# EAGLE design esquema_placa_v2 (EAGLE 9.4.2)
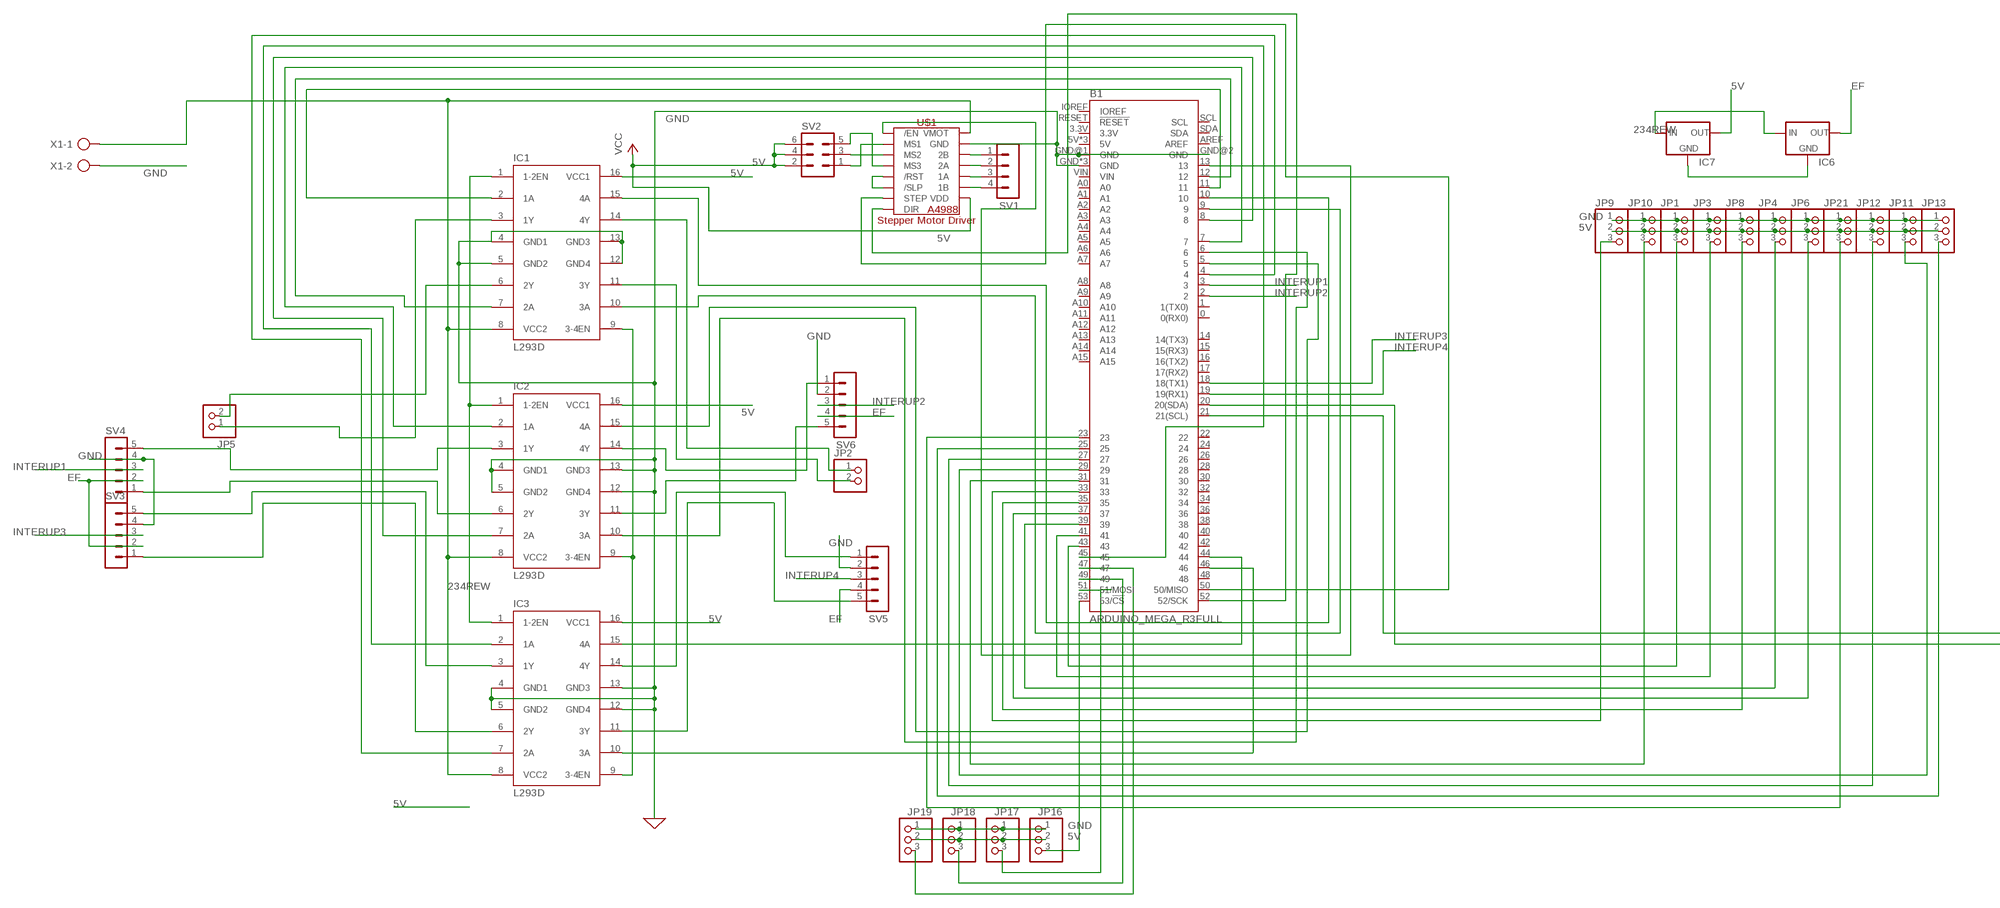
[diagram p0: schematic, sheet 1, part 1 of 2]
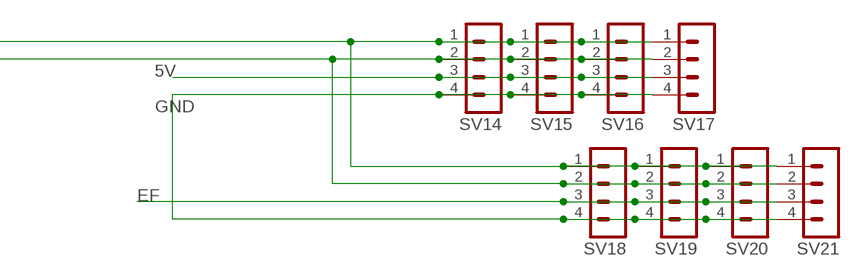
[diagram p1: schematic, sheet 1, part 2 of 2]

## Parts
B1  ARDUINO_MEGA_R3FULL  [ARDUINO_MEGA_NO_SILK]
IC1  L293D  [DIL16]
IC2  L293D  [DIL16]
IC3  L293D  [DIL16]
IC6  78XXS  [78XXS]
IC7  78XXS  [78XXS]
JP1  PINHD-1X3  [1X03]
JP2  PINHD-1X2  [1X02]
JP3  PINHD-1X3  [1X03]
JP4  PINHD-1X3  [1X03]
JP5  PINHD-1X2  [1X02]
JP6  PINHD-1X3  [1X03]
JP8  PINHD-1X3  [1X03]
JP9  PINHD-1X3  [1X03]
JP10  PINHD-1X3  [1X03]
JP11  PINHD-1X3  [1X03]
JP12  PINHD-1X3  [1X03]
JP13  PINHD-1X3  [1X03]
JP16  PINHD-1X3  [1X03]
JP17  PINHD-1X3  [1X03]
JP18  PINHD-1X3  [1X03]
JP19  PINHD-1X3  [1X03]
JP21  PINHD-1X3  [1X03]
SV1  MA04-1  [MA04-1]
SV2  MA03-2  [MA03-2]
SV3  MA05-1  [MA05-1]
SV4  MA05-1  [MA05-1]
SV5  MA05-1  [MA05-1]
SV6  MA05-1  [MA05-1]
SV14  MA04-1  [MA04-1]
SV15  MA04-1  [MA04-1]
SV16  MA04-1  [MA04-1]
SV17  MA04-1  [MA04-1]
SV18  MA04-1  [MA04-1]
SV19  MA04-1  [MA04-1]
SV20  MA04-1  [MA04-1]
SV21  MA04-1  [MA04-1]
U$1  A4988_STEP  [A4988_STEP]
X1  AK500/2-H  [AK500/2-H]

## Nets
5V: IC1.1(1-2EN) IC1.9(3-4EN) IC1.16(VCC1) IC2.1(1-2EN) IC2.9(3-4EN) IC2.16(VCC1) IC3.1(1-2EN) IC3.9(3-4EN) IC3.16(VCC1) IC7.OUT JP1.2 JP3.2 JP4.2 JP6.2 JP8.2 JP9.2 JP10.2 JP11.2 JP12.2 JP13.2 JP16.2 JP17.2 JP18.2 JP19.2 JP21.2 SV2.2 SV2.4 SV2.6 SV14.3 SV15.3 SV16.3 SV17.3 U$1.VDD ; supply symbol labelled VCC
234REW: IC1.8(VCC2) IC2.8(VCC2) IC3.8(VCC2) IC6.IN IC7.IN U$1.VMOT X1.1
EF: IC6.OUT SV3.2 SV4.2 SV5.4 SV6.4 SV18.3 SV19.3 SV20.3 SV21.3
GND: B1.GND B1.GND@1(GND) B1.GND@2(GND) B1.GND@3(GND) B1.GND@4(GND) IC1.4(GND1) IC1.5(GND2) IC1.12(GND4) IC1.13(GND3) IC2.4(GND1) IC2.5(GND2) IC2.12(GND4) IC2.13(GND3) IC3.4(GND1) IC3.5(GND2) IC3.12(GND4) IC3.13(GND3) IC6.GND IC7.GND JP1.1 JP3.1 JP4.1 JP6.1 JP8.1 JP9.1 JP10.1 JP11.1 JP12.1 JP13.1 JP16.1 JP17.1 JP18.1 JP19.1 JP21.1 SV3.4 SV4.4 SV5.2 SV6.2 SV14.4 SV15.4 SV16.4 SV17.4 SV18.4 SV19.4 SV20.4 SV21.4 U$1.GND U$1.GND2(GND) X1.2
INTERUP1: B1.3 SV4.3
INTERUP2: B1.2 SV6.3
INTERUP3: B1.18(18(TX1)) SV3.3
INTERUP4: B1.19(19(RX1)) SV5.3
N$1: B1.53(53/!CS) JP16.3
N$2: IC1.3(1Y) JP5.1
N$3: IC1.6(2Y) JP5.2
N$4: IC2.3(1Y) SV4.5
N$5: B1.45 IC3.2(1A)
N$6: IC2.6(2Y) SV4.1
N$7: IC3.3(1Y) SV3.5
N$8: IC3.6(2Y) SV3.1
N$9: IC2.14(4Y) SV6.1
N$10: IC2.11(3Y) SV6.5
N$11: IC3.14(4Y) SV5.1
N$12: IC3.11(3Y) SV5.5
N$13: IC1.11(3Y) JP2.2
N$14: IC1.14(4Y) JP2.1
N$15: B1.12 IC1.7(2A)
N$16: B1.11 IC1.2(1A)
N$17: B1.7 IC2.2(1A)
N$18: B1.8 IC2.7(2A)
N$19: B1.43 JP1.3
N$20: B1.4 IC3.7(2A)
N$21: B1.10 IC1.15(4A)
N$22: B1.9 IC1.10(3A)
N$23: B1.5 IC2.15(4A)
N$24: B1.6 IC2.10(3A)
N$25: U$1./RST U$1./SLP
N$26: B1.46 IC3.10(3A)
N$27: B1.41 JP3.3
N$28: SV1.1 U$1.2B
N$29: SV1.2 U$1.2A
N$30: SV1.3 U$1.1A
N$31: SV1.4 U$1.1B
N$32: SV2.3 U$1.MS2
N$33: SV2.1 U$1.MS1
N$34: SV2.5 U$1.MS3
N$35: B1.44 IC3.15(4A)
N$36: B1.13 U$1./EN
N$37: B1.50(50/MISO) U$1.STEP
N$38: B1.52(52/SCK) U$1.DIR
N$39: B1.39 JP4.3
N$40: B1.51(51/MOSI) JP17.3
N$41: B1.49 JP18.3
N$42: B1.47 JP19.3
N$43: B1.37 JP6.3
N$44: B1.35 JP8.3
N$45: B1.33 JP9.3
N$46: B1.31 JP10.3
N$47: B1.29 JP11.3
N$48: B1.27 JP12.3
N$49: B1.25 JP13.3
N$50: B1.20(20(SDA)) SV14.2 SV15.2 SV16.2 SV17.2 SV18.2 SV19.2 SV20.2 SV21.2
N$52: B1.23 JP21.3
N$57: B1.21(21(SCL)) SV14.1 SV15.1 SV16.1 SV17.1 SV18.1 SV19.1 SV20.1 SV21.1
Unconnected: B1.0(0(RX0)) B1.1(1(TX0)) B1.3.3V B1.5V B1.5V@1(5V) B1.5V@2(5V) B1.14(14(TX3)) B1.15(15(RX3)) B1.16(16(TX2)) B1.17(17(RX2)) B1.22 B1.24 B1.26 B1.28 B1.30 B1.32 B1.34 B1.36 B1.38 B1.40 B1.42 B1.48 B1.A0 B1.A1 B1.A2 B1.A3 B1.A4 B1.A5 B1.A6 B1.A7 B1.A8 B1.A9 B1.A10 B1.A11 B1.A12 B1.A13 B1.A14 B1.A15 B1.AREF B1.IOREF B1.RESET(!RESET) B1.SCL B1.SDA B1.VIN

## Library data of the parts
B1 = Arduino:ARDUINO_MEGA_R3: Arduino Mega R3 ATmega2560 R3 compatible footprint. SparkFun Products: Arduino Mega 2560 R3 <https://www.sparkfun.com/products/11061>
IC1-IC3 = st-microelectronics:L293D: PUSH-PULL 4 CHANNEL DRIVER; MPN: L293D; OC_FARNELL: 9589619; OC_NEWARK: 56P8249
IC6 IC7 = v-reg:78XXS: VOLTAGE REGULATOR
JP1 JP3 JP4 JP6 JP8-JP13 JP16-JP19 JP21 = pinheadRounded:PINHD-1X3: PIN HEADER
JP2 JP5 = pinhead:PINHD-1X2: PIN HEADER
SV1 = con-lstb:MA04-1: PIN HEADER; OC_FARNELL: unknown; OC_NEWARK: unknown
SV2 = con-lstb:MA03-2: PIN HEADER; OC_FARNELL: unknown; OC_NEWARK: unknown
SV3-SV6 = con-lstb:MA05-1: PIN HEADER; OC_FARNELL: unknown; OC_NEWARK: unknown
SV14-SV21 = pin4round:MA04-1: PIN HEADER; OC_FARNELL: unknown; OC_NEWARK: unknown
U$1 = IC:A4988_STEP
X1 = con-ptr500:AK500/2-H: CONNECTOR Aug. 2004 / PTR Meßtechnik: Die Bezeichnung der Serie AK505 wurde geändert. Es handelt sich hierbei um AK500 in horizontaler Ausführung.; OC_FARNELL: unknown; OC_NEWARK: unknown

## Board
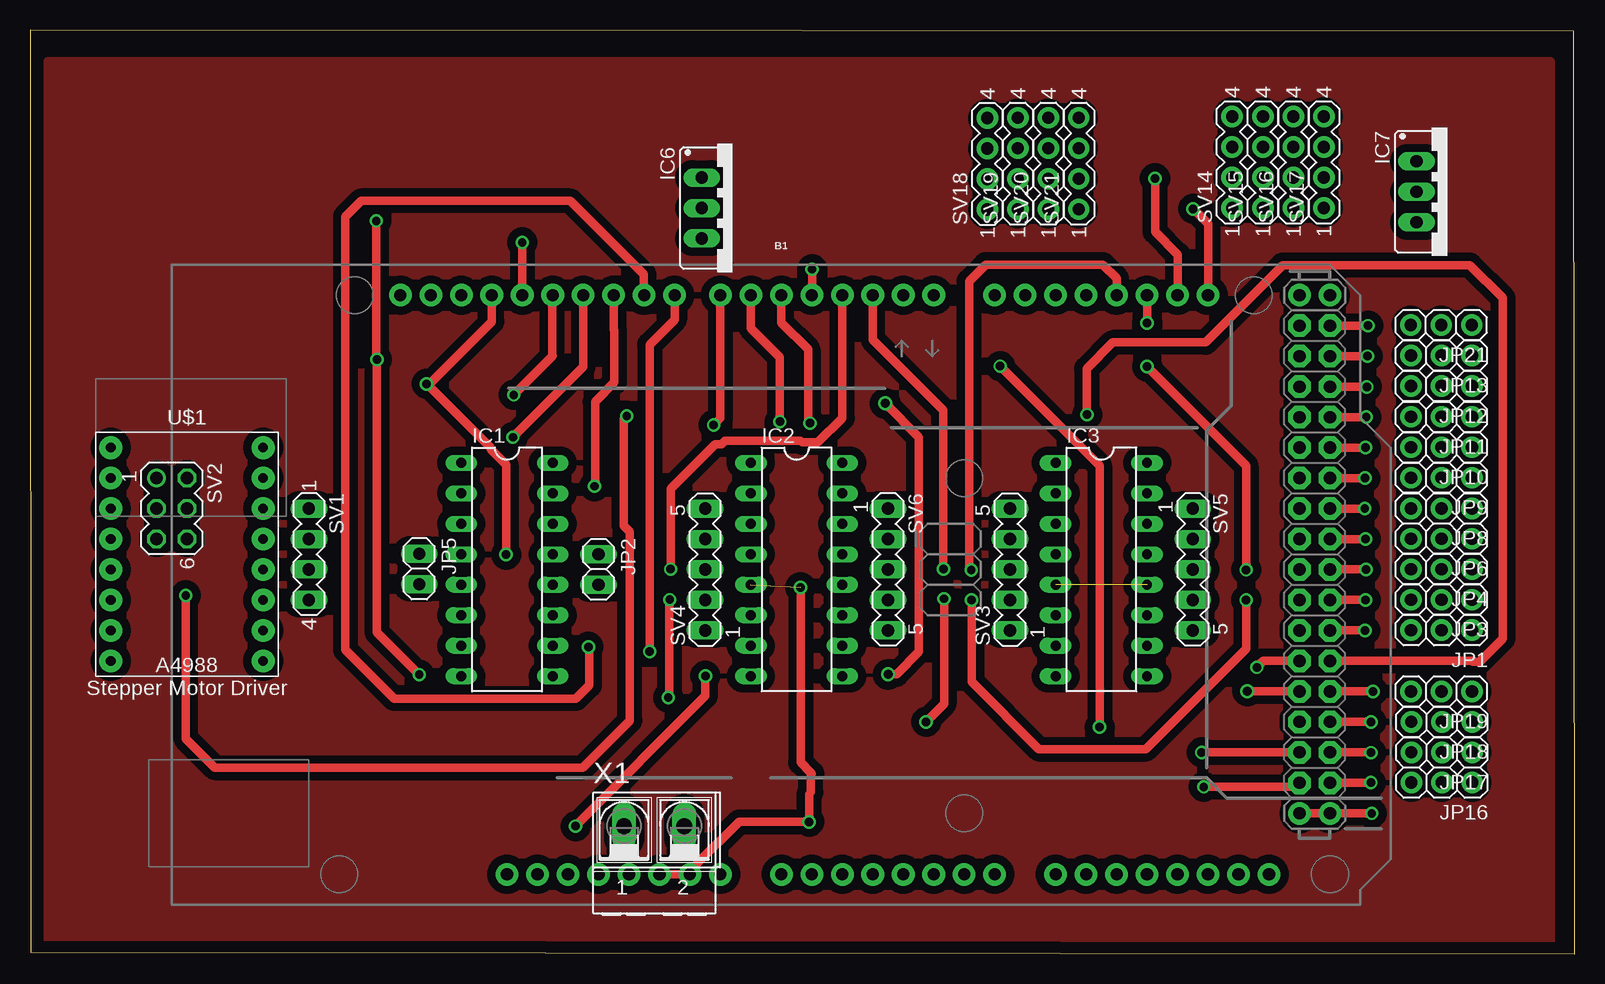
[diagram p2: board, top side]
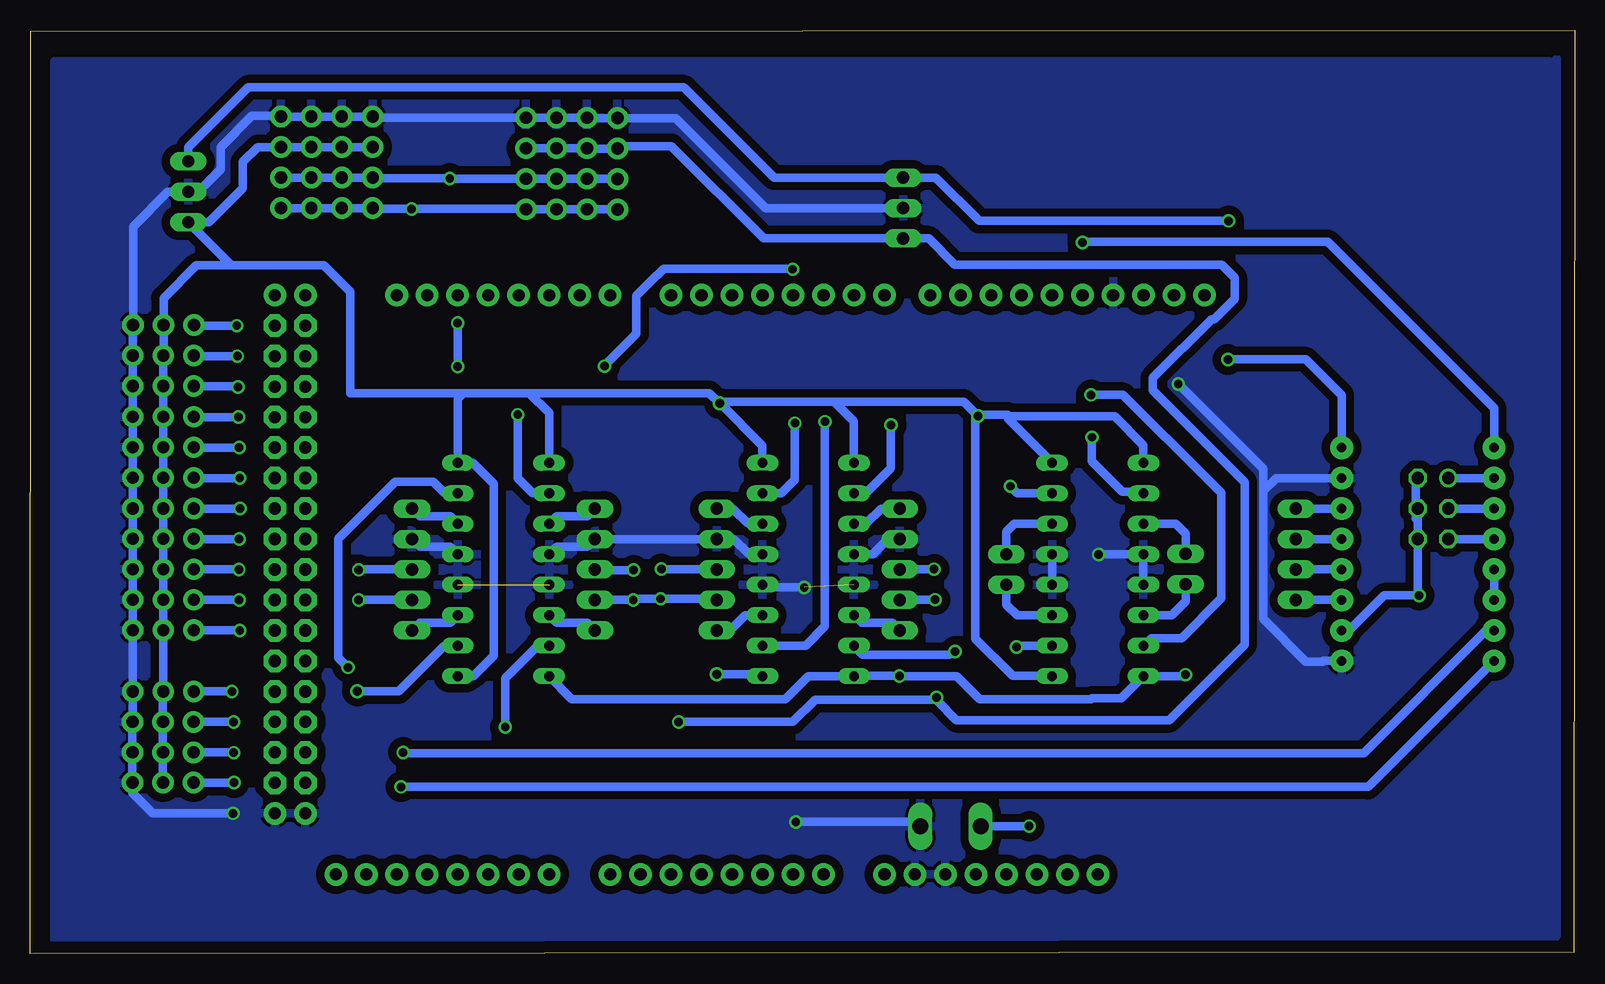
[diagram p3: board, bottom side, seen from below]

Size 128.73 x 76.96 mm. Coordinates in mm from the lower left corner, seen from the top.
Outline: 0.08,0.1 128.73,0 128.66,76.86 0,76.96 0.08,0.1
Copper layers (1*16): Top 0.035mm / dielectric 1.5mm / Bottom 0.035mm
Design rules "default *": minimum track width 0.7mm, minimum drill 0.7mm, track to track 0.7mm, track to pad 0.7mm, pad to pad 0.5mm, via to via 0.5mm, smd to smd 6mil, copper to edge 1mm, drill to drill 0.5mm, minimum pad ring 10mil, minimum via ring 8mil, stop-mask expansion 4mil, vias tented up to drill 0mil, thermal gap 10mil

### Footprints (pad centres in the part's own frame; a part is rotated, then mirrored left to right if it is on the bottom)
ARDUINO_MEGA_NO_SILK = drill 1.016 pad 1.88: 0 13.97,24.13; 1 11.43,24.13; 2 8.89,24.13; 3 6.35,24.13; 3.3V -13.97,-24.13; 4 3.81,24.13; 5 1.27,24.13; 5V -11.43,-24.13; 5V@1 44.45,24.13; 5V@2 46.99,24.13; 6 -1.27,24.13; 7 -3.81,24.13; 8 -7.62,24.13; 9 -10.16,24.13; 10 -12.7,24.13; 11 -15.24,24.13; 12 -17.78,24.13; 13 -20.32,24.13; 14 19.05,24.13; 15 21.59,24.13; 16 24.13,24.13; 17 26.67,24.13; 18 29.21,24.13; 19 31.75,24.13; 20 34.29,24.13; 21 36.83,24.13; A0 1.27,-24.13; A1 3.81,-24.13; A2 6.35,-24.13; A3 8.89,-24.13; A4 11.43,-24.13; A5 13.97,-24.13; A6 16.51,-24.13; A7 19.05,-24.13; A8 24.13,-24.13; A9 26.67,-24.13; A10 29.21,-24.13; A11 31.75,-24.13; A12 34.29,-24.13; A13 36.83,-24.13; A14 39.37,-24.13; A15 41.91,-24.13; AREF -25.4,24.13; GND -8.89,-24.13; GND@1 -6.35,-24.13; GND@2 44.45,-19.05; GND@3 46.99,-19.05; GND@4 -22.86,24.13; IOREF -19.05,-24.13; NC -21.59,-24.13; RESET -16.51,-24.13; SCL -30.48,24.13; SDA -27.94,24.13; VIN -3.81,-24.13 | drill 1.016 pad 1.88 octagon: 22 44.45,21.59; 23 46.99,21.59; 24 44.45,19.05; 25 46.99,19.05; 26 44.45,16.51; 27 46.99,16.51; 28 44.45,13.97; 29 46.99,13.97; 30 44.45,11.43; 31 46.99,11.43; 32 44.45,8.89; 33 46.99,8.89; 34 44.45,6.35; 35 46.99,6.35; 36 44.45,3.81; 37 46.99,3.81; 38 44.45,1.27; 39 46.99,1.27; 40 44.45,-1.27; 41 46.99,-1.27; 42 44.45,-3.81; 43 46.99,-3.81; 44 44.45,-6.35; 45 46.99,-6.35; 46 44.45,-8.89; 47 46.99,-8.89; 48 44.45,-11.43; 49 46.99,-11.43; 50 44.45,-13.97; 51 46.99,-13.97; 52 44.45,-16.51; 53 46.99,-16.51
DIL16 = drill 0.813 long: 1 -8.89,-3.81; 2 -6.35,-3.81; 3 -3.81,-3.81; 4 -1.27,-3.81; 5 1.27,-3.81; 6 3.81,-3.81; 7 6.35,-3.81; 8 8.89,-3.81; 9 8.89,3.81; 10 6.35,3.81; 11 3.81,3.81; 12 1.27,3.81; 13 -1.27,3.81; 14 -3.81,3.81; 15 -6.35,3.81; 16 -8.89,3.81
78XXS = drill 1.016 long: GND 0,-2.54; IN -2.54,-2.54; OUT 2.54,-2.54
1X03 = drill 1.016 pad 1.778: 1 -2.54,0; 2 0,0; 3 2.54,0
1X02 = drill 1.016 long: 1 -1.27,0; 2 1.27,0
MA04-1 = drill 1.016 long: 1 -3.81,0; 2 -1.27,0; 3 1.27,0; 4 3.81,0
MA03-2 = drill 1.016: 1 -2.54,-1.27 | drill 1.016 octagon: 2 -2.54,1.27; 3 0,-1.27; 4 0,1.27; 5 2.54,-1.27; 6 2.54,1.27
MA05-1 = drill 1.016 long: 1 -5.08,0; 2 -2.54,0; 3 0,0; 4 2.54,0; 5 5.08,0
MA04-1' = drill 1.016 pad 1.778: 1 -3.81,0; 2 -1.27,0; 3 1.27,0; 4 3.81,0
A4988_STEP = drill 0.8 pad 1.905: 1A 6.35,-1.27; 1B 6.35,-3.81; 2A 6.35,1.27; 2B 6.35,3.81; /EN -6.35,8.89; /RST -6.35,-1.27; /SLP -6.35,-3.81; DIR -6.35,-8.89; GND 6.35,6.35; GND2 6.35,-8.89; MS1 -6.35,6.35; MS2 -6.35,3.81; MS3 -6.35,1.27; STEP -6.35,-6.35; VDD 6.35,-6.35; VMOT 6.35,8.89
AK500/2-H = drill 1.321 long: 1 -2.515,0; 2 2.515,0

### Placement (x,y rotation side)
B1  61.34,30.73 0 top
IC1  39.75,32 270 top
IC2  63.88,32 270 top
IC3  89.28,32 270 top
IC6  58.52,62.13 270 top
IC7  118.08,63.47 270 top
JP1  117.63,26.95 180 top
JP2  47.37,32 270 top
JP3  117.63,29.49 180 top
JP4  117.63,32.03 180 top
JP5  32.44,32.05 270 top
JP6  117.63,34.57 180 top
JP8  117.63,37.08 180 top
JP9  117.63,39.65 180 top
JP10  117.63,42.19 180 top
JP11  117.63,44.73 180 top
JP12  117.63,47.29 180 top
JP13  117.63,49.83 180 top
JP16  117.65,14.25 180 top
JP17  117.65,16.76 180 top
JP18  117.65,19.3 180 top
JP19  117.63,21.84 180 top
JP21  117.6,52.37 180 top
SV1  23.24,33.27 270 top
SV2  11.81,37.08 270 top
SV3  81.66,32 90 top
SV4  56.26,32 90 top
SV5  96.9,32 270 top
SV6  71.5,32 270 top
SV14  [MA04-1']  100.18,65.94 90 top
SV15  [MA04-1']  102.74,65.94 90 top
SV16  [MA04-1']  105.28,65.94 90 top
SV17  [MA04-1']  107.82,65.94 90 top
SV18  [MA04-1']  79.78,65.81 90 top
SV19  [MA04-1']  82.32,65.84 90 top
SV20  [MA04-1']  84.86,65.84 90 top
SV21  [MA04-1']  87.4,65.84 90 top
U$1  13.08,33.27 0 top
X1  52.02,10.62 0 top

### Tracks (layer width: path | path; a pad name or v marks a point on that pad's centre or on a via)
5V  (via drill 0.7, 0.75)
  Top 0.7: v12.98,29.85 12.98,17.91 15.39,15.49 46.08,15.49 49.99,19.41 49.99,35.15 49.48,35.66 49.48,44.55 v49.73,44.81 | v71.5,23.27 72.21,23.27 74.07,25.13 74.07,43.04 v71.27,45.85
  Bottom 0.7: U$1.VDD 18.8,26.92 15.87,29.85 v12.98,29.85 13.08,29.95 SV2.6 | IC2.16 67.69,42.32 71.22,45.85 v71.27,45.85 | 92.61,46.71 93.09,46.23 IC3.16 91.82,40.89 90.09,39.17 90.09,24.82 91.8,23.11 IC3.9 92.02,23.11 91.97,23.06 | 87.12,46.71 92.61,46.71 | SV2.2 13.23,39.47 13.23,36.98 | 13.23,36.98 13.23,36.22 13.08,36.37 SV2.4 | SV2.6 13.08,36.83 13.23,36.98 | 12.98,34.44 SV2.6 | 61.7,46 50.93,46 v49.73,44.81 | 111.96,57.35 104.24,57.35 102.03,55.14 102.03,46.71 92.61,46.71 | 111.96,57.35 114.86,57.35 117.6,54.61 JP21.2 117.6,49.86 JP13.2 JP12.2 JP11.2 JP10.2 JP9.2 JP8.2 JP6.2 JP4.2 JP3.2 JP1.2 JP19.2 117.65,21.82 JP18.2 JP17.2 JP16.2 | IC1.1 35.94,42.34 38.36,44.76 47.27,44.76 | IC1.9 43.59,23.14 46.84,23.14 49.94,26.25 49.94,44.59 v49.73,44.81 | v49.73,44.81 49.63,44.91 47.27,44.91 47.27,44.76 | 47.27,44.76 47.27,44.6 IC1.16 | IC2.1 60.07,44.37 61.7,46 | IC3.1 85.47,45.06 87.12,46.71 | SV14.3 SV15.3 SV16.3 SV17.3 109.75,67.21 111,65.96 111,63.78 113.84,60.93 IC7.OUT 111.96,57.35 | 61.7,46 71.12,46 v71.27,45.85 | v71.27,45.85 72.14,46.71 87.12,46.71 | IC2.9 67.84,23.27 v71.5,23.27
234REW  (via drill 0.7)
  Top 0.7: v28.85,61.06 28.87,61.05 28.87,49.54 v28.9,49.5 28.9,26.77 v32.44,23.24 | 56.36,23.06 v56.29,23.14 56.29,21.46 45.47,10.64 v45.47,10.62
  Bottom 0.7: IC3.8 83.57,21.21 65.79,21.21 63.88,23.11 IC2.8 60.05,23.14 v56.29,23.14 | U$1.VMOT 19.43,46.53 22.4,49.5 v28.9,49.5 | 56.31,23.11 v56.29,23.14 | v56.29,23.14 56.26,23.11 51.49,23.11 49.58,21.21 40.28,21.21 40.23,21.26 37.79,21.26 IC1.8 32.56,23.11 v32.44,23.24 | X1.1 v45.47,10.62 | v28.85,61.06 49.63,61.06 53.24,64.67 IC6.IN 66.73,64.67 74.24,72.19 110.54,72.19 115.54,67.18 IC7.IN
EF  (via drill 0.7)
  Top 0.7: v53.31,29.49 53.29,29.46 53.29,21.44 v53.19,21.34 | v101.35,29.46 101.35,25.4 92.99,17.04 84.07,17.04 78.46,22.66 v78.46,29.46 78.49,29.44 | v76.17,29.57 76.17,20.8 v74.68,19.3
  Bottom 0.7: v74.68,19.3 65.15,19.3 63.3,21.16 53.37,21.16 v53.19,21.34 53.19,21.11 51.54,19.46 33.78,19.46 27.51,25.73 27.51,39.29 35.15,46.94 35.15,47.98 30.26,52.87 30.04,52.87 28.35,54.56 28.35,56.34 29.41,57.4 51.66,57.4 53.85,59.59 IC6.OUT 67.59,59.59 75.29,67.28 79.58,67.28 SV18.3 82.3,67.08 SV19.3 SV20.3 SV21.3 | SV5.4 v101.35,29.46 | SV4.2 53.31,29.46 v53.31,29.49 53.14,29.49 | SV6.4 71.6,29.57 v76.17,29.57 78.36,29.57 v78.46,29.46 SV3.2
GND  (via drill 0.7)  (2 unrouted)
  Top 0.7: 65.07,15.06 64.21,15.93 v64.21,30.51 | 65.07,15.06 65.15,14.99 | 65.07,15.06 65.07,13.44 64.92,13.28 v64.92,10.97 59.09,10.97 55.54,7.43 55.54,7.15 B1.GND@1 B1.GND | v39.67,33.25 39.67,40.74 38.38,42.04 38.38,42.14 v33.05,47.47 33.3,47.47 38.48,52.65 B1.GND@4 | v111.81,11.68 B1.GND@3 B1.GND@2
  Bottom 0.7: SV5.2 96.27,33.91 93.73,33.91 IC3.13 | SV4.4 57.25,34.54 58.52,33.27 IC2.4 | IC2.13 67.72,33.3 68.83,33.3 70.08,34.54 SV6.2 SV3.4 82.3,33.91 84.84,33.91 IC3.4 | IC1.5 IC1.4 39.65,33.27 v39.67,33.25 | IC1.12 IC1.13 | U$1.GND2 20.95,24.38 21.01,24.33 22.4,24.33 25.96,27.89 25.96,38.56 | 25.96,38.56 24.89,39.62 U$1.GND | IC2.12 67.46,30.51 v64.21,30.51 | IC6.GND 67.44,62.13 74.93,69.62 SV18.4 82.3,69.62 SV19.4 SV20.4 SV21.4 100.08,69.65 SV14.4 SV15.4 SV16.4 SV17.4 107.87,69.8 110.24,69.8 112.83,67.21 112.83,65.35 114.71,63.47 IC7.GND 117.25,63.47 120.14,60.58 JP21.1 120.17,52.35 JP13.1 JP12.1 JP11.1 JP10.1 JP9.1 JP8.1 JP6.1 JP4.1 JP3.1 JP1.1 JP19.1 120.17,19.33 JP18.1 JP17.1 JP16.1 120.22,14.22 120.22,13.39 118.52,11.68 v111.81,11.68 | v33.05,47.47 25.96,40.39 25.96,38.56 | v64.92,10.97 54.89,10.97 X1.2
  pour Bottom: 1.52,74.63 1.52,1.47 1.98,1.02 126.54,1.02 126.7,1.17 126.7,74.35 2.13,74.35 1.83,74.04
INTERUP1  (via drill 0.7)
  Top 0.7: v53.39,32.03 53.39,38.74 57.1,42.44 57.64,42.44 57.92,42.72 64.21,42.72 64.33,42.59 65.66,42.59 67.69,44.62 B1.3
  Bottom 0.7: SV4.3 53.42,32 v53.39,32.03
INTERUP2  (via drill 0.7)
  Top 0.7: v76.12,32.06 76.12,45.26 70.23,51.16 B1.2
  Bottom 0.7: SV6.3 76.07,32 v76.12,32.06
INTERUP3  (via drill 0.7)
  Top 0.7: v78.43,31.95 78.26,32.13 78.26,56.03 79.63,57.4 89.41,57.4 90.55,56.26 B1.18
  Bottom 0.7: SV3.3 81.61,31.95 v78.43,31.95
INTERUP4  (via drill 0.7)
  Top 0.7: v93.09,48.92 101.35,40.67 v101.35,31.98 | B1.19 v93.09,52.55
  Bottom 0.7: SV5.3 101.32,32 v101.35,31.98 | v93.09,52.55 v93.09,48.92
MALHA
  pour Top: 1.5,74.35 1.5,0.99 126.75,0.99 126.75,74.35
N$1  (via drill 0.7)
  Top 0.7: v111.73,14.25 111.71,14.22 B1.53
  Bottom 0.7: JP16.3 v111.73,14.25
N$2
  Bottom 0.7: JP5.1 32.44,35 33.25,35.81 IC1.3
N$3
  Bottom 0.7: JP5.2 32.44,29.36 33.6,28.19 IC1.6
N$4
  Bottom 0.7: IC2.3 59.08,35.81 57.81,37.08 SV4.5
N$5  (via drill 0.7)
  Top 0.7: v88.09,44.91 88.06,44.93 88.06,48.74 90.25,50.93 97.97,50.93 97.97,50.95 104.39,57.38 119.99,57.38 122.73,54.64 122.73,26.24 120.83,24.33 120.24,24.33 120.19,24.38 B1.45
  Bottom 0.7: v88.09,44.91 88.09,39.6 86.84,38.35 IC3.2
N$6
  Bottom 0.7: IC2.6 59.44,27.56 56.9,27.56 SV4.1
N$7
  Bottom 0.7: IC3.3 84.84,36.45 82.3,36.45 SV3.5
N$8
  Bottom 0.7: IC3.6 84.84,27.56 82.3,27.56 SV3.1
N$9
  Bottom 0.7: IC2.14 67.51,35.81 67.49,35.84 68.91,35.84 70.15,37.08 SV6.1
N$10
  Bottom 0.7: IC2.11 69.11,28.19 70.38,26.92 SV6.5
N$11
  Bottom 0.7: IC3.14 93.73,36.45 96.27,36.45 SV5.1
N$12
  Bottom 0.7: IC3.11 93.73,27.56 96.27,27.56 SV5.5
N$13
  Bottom 0.7: JP2.2 47.37,29.08 46.48,28.19 IC1.11
N$14
  Bottom 0.7: JP2.1 47.37,35.15 46.71,35.81 IC1.14
N$15  (via drill 0.7)
  Top 0.7: v40.31,46.56 43.55,49.8 43.54,49.81 43.54,54.84 B1.12
  Bottom 0.7: IC1.7 35.31,26.29 32.77,26.29 29.46,29.59 29.46,38.41 34.04,42.99 34.1,42.99 37.67,46.56 v40.31,46.56
N$16  (via drill 0.7)
  Top 0.7: v40.23,43.03 46.1,48.9 B1.11
  Bottom 0.7: IC1.2 36.07,38.48 37.69,38.48 40.23,41.02 v40.23,43.03
N$17  (via drill 0.7)
  Top 0.7: B1.7 57.53,44.6 v56.97,44.04
  Bottom 0.7: v56.97,44.04 57,44.04 57,40.46 59.11,38.35 IC2.2
N$18  (via drill 0.7)
  Top 0.7: v51.64,25.17 51.64,50.75 53.72,52.83 B1.8
  Bottom 0.7: IC2.7 59.33,24.92 52.1,24.92 51.84,25.17 v51.64,25.17
N$19  (via drill 0.7)
  Top 0.7: B1.43 v111.25,26.92
  Bottom 0.7: JP1.3 115.06,26.92 v111.25,26.92
N$20  (via drill 0.7)
  Top 0.7: v80.85,48.95 89.13,40.67 v89.13,18.87 | v65.18,57.02 65.18,54.89 B1.4
  Bottom 0.7: IC3.7 86.41,25.65 89.13,22.94 v89.13,18.87 | v80.85,48.95 80.85,49.02 78.21,51.66 78.21,54.81 76.5,56.52 76.47,56.52 75.91,57.08 65.24,57.08 v65.18,57.02
N$21  (via drill 0.7)
  Top 0.7: 47.07,38.96 v47.04,38.94 47.09,38.99 47.09,46 48.69,47.6 48.69,51.94 48.64,51.99 B1.10
  Bottom 0.7: IC1.15 46.46,38.35 v47.04,38.94
N$22  (via drill 0.7)
  Top 0.7: v46.53,25.55 46.53,25.37 46.61,25.3 46.61,22.35 45.49,21.23 30.35,21.23 26.29,25.3 26.29,61.42 27.59,62.72 45.03,62.72 51.16,56.59 51.16,55.5 51.18,55.47 B1.9
  Bottom 0.7: IC1.10 46.43,25.65 v46.53,25.55
N$23  (via drill 0.7)
  Top 0.7: v65,44.2 64.85,44.35 64.85,50.34 62.61,52.58 B1.5
  Bottom 0.7: v65,44.2 65,39.5 66.14,38.35 IC2.15
N$24  (via drill 0.7)
  Top 0.7: 62.53,44.27 v62.48,44.32 62.48,49.71 60.07,52.12 B1.6
  Bottom 0.7: v62.48,44.32 62.48,27.25 64.08,25.65 IC2.10
N$25
  Bottom 0.7: U$1./RST U$1./SLP
N$26  (via drill 0.75)
  Top 0.7: v101.45,21.87 105.77,21.87 B1.46
  Bottom 0.7: IC3.10 94.21,25.65 98.02,21.84 101.42,21.84 v101.45,21.87
N$27  (via drill 0.7)
  Top 0.7: v111.3,29.46 B1.41
  Bottom 0.7: v111.3,29.46 115.06,29.46 JP3.3
N$28
  Bottom 0.7: U$1.2B SV1.1
N$29
  Bottom 0.7: U$1.2A SV1.2
N$30
  Bottom 0.7: U$1.1A SV1.3
N$31
  Bottom 0.7: U$1.1B SV1.4
N$32
  Bottom 0.7: U$1.MS2 SV2.3
N$33
  Bottom 0.7: U$1.MS1 SV2.1
N$34
  Bottom 0.7: U$1.MS3 SV2.5
N$35  (via drill 0.7)
  Top 0.7: v102.23,23.85 102.77,24.38 B1.44
  Bottom 0.7: IC3.15 94.18,38.35 95.15,39.32 98.3,39.32 103.05,34.57 103.05,24.66 v102.23,23.85
N$36  (via drill 0.7)
  Top 0.7: v41.02,59.26 B1.13
  Bottom 0.7: U$1./EN 6.73,45.44 20.6,59.31 40.97,59.31 v41.02,59.26
N$37  (via drill 0.7)
  Top 0.7: v97.64,16.76 B1.50
  Bottom 0.7: U$1.STEP 7.37,26.92 17.6,16.69 97.51,16.69 97.59,16.76 v97.64,16.76
N$38  (via drill 0.7)
  Top 0.7: v97.82,13.89 105.46,13.89 B1.52
  Bottom 0.7: U$1.DIR 17.22,13.89 v97.82,13.89
N$39  (via drill 0.7)
  Top 0.7: B1.39 v111.33,32
  Bottom 0.7: JP4.3 111.35,32.03 v111.33,32
N$40  (via drill 0.7)
  Top 0.7: B1.51 111.73,16.76 v111.76,16.74
  Bottom 0.7: v111.76,16.74 111.79,16.76 JP17.3
N$41  (via drill 0.7)
  Top 0.7: v111.76,19.3 B1.49
  Bottom 0.7: JP18.3 v111.76,19.3
N$42  (via drill 0.7)
  Top 0.7: v111.91,21.84 B1.47
  Bottom 0.7: v111.91,21.84 JP19.3
N$43  (via drill 0.7)
  Top 0.7: v111.3,34.54 B1.37
  Bottom 0.7: v111.3,34.54 115.06,34.54 JP6.3
N$44  (via drill 0.7)
  Top 0.7: B1.35 v111.23,37.08
  Bottom 0.7: JP8.3 v111.23,37.08
N$45  (via drill 0.7)
  Top 0.7: v111.25,39.62 B1.33
  Bottom 0.7: v111.25,39.62 115.06,39.62 JP9.3
N$46  (via drill 0.7)
  Top 0.7: B1.31 v111.3,42.16
  Bottom 0.7: v111.3,42.16 115.06,42.16 JP10.3
N$47  (via drill 0.7)
  Top 0.7: v111.35,44.7 B1.29
  Bottom 0.7: JP11.3 115.06,44.7 v111.35,44.7
N$48  (via drill 0.7)
  Top 0.7: B1.27 111.38,47.24 v111.4,47.22
  Bottom 0.7: v111.4,47.22 111.48,47.3 JP12.3
N$49  (via drill 0.7)
  Top 0.7: v111.45,49.78 B1.25
  Bottom 0.7: JP13.3 115.04,49.78 v111.45,49.78
N$50  (via drill 0.7)
  Top 0.7: B1.20 95.66,54.89 95.66,58.24 93.75,60.15 v93.75,64.59
  Bottom 0.7: SV17.2 SV16.2 SV15.2 SV14.2 100.08,64.57 100.05,64.59 v93.75,64.59 93.73,64.57 SV21.2 SV20.2 SV19.2 79.81,64.57 SV18.2
N$52  (via drill 0.7)
  Top 0.7: B1.23 v111.51,52.32
  Bottom 0.7: v111.51,52.32 115.01,52.32 JP21.3
N$57  (via drill 0.7)
  Top 0.7: B1.21 98.17,60.81 v96.93,62.05
  Bottom 0.7: B1.21 98.12,54.92 | 100.48,62.13 SV14.1 100.08,62.03 | 100.48,62.13 SV15.1 SV16.1 SV17.1 | SV18.1 79.81,62.03 SV19.1 SV20.1 87.07,62.03 | 87.07,62.03 SV21.1 | 87.07,62.03 87.1,62.05 v96.93,62.05 100.41,62.05 100.48,62.13